# EAGLE design Soundtrap IMU board v4 RXTX switch (EAGLE 9.5.2)
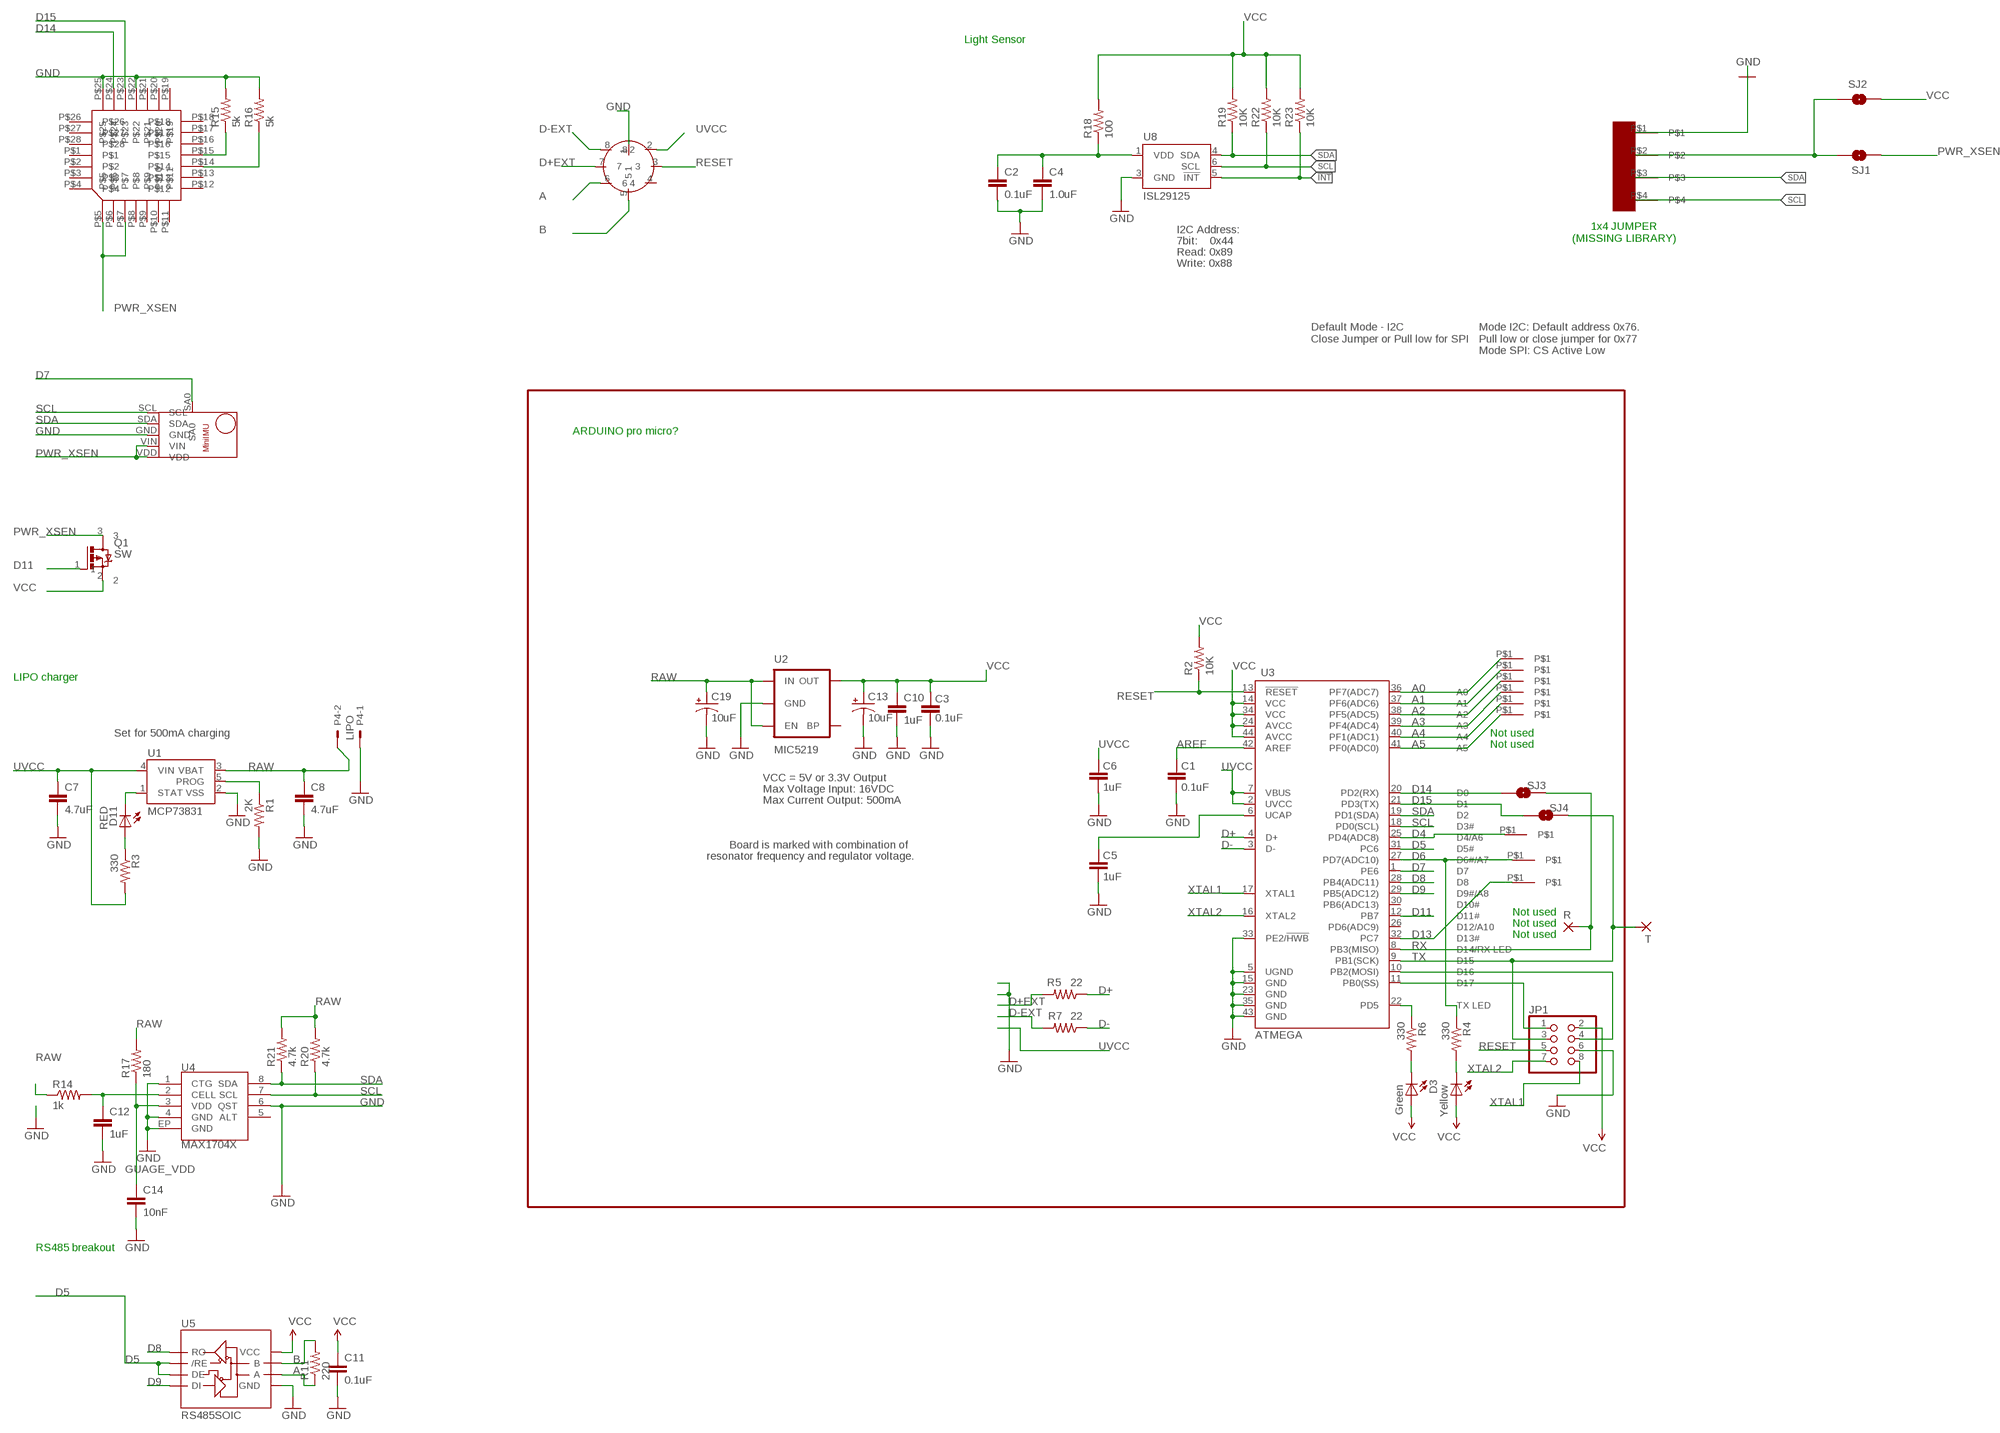
[diagram p0: schematic, sheet 1]

## Parts
C1  0.1uF  CAP0603-CAP  [0603-CAP]
C2  0.1uF  0.1UF-25V(+80/-20%)(0603)  [0603-CAP]
C3  0.1uF  CAP0603-CAP  [0603-CAP]
C4  1.0uF  1.0UF-16V-10%(0603)  [0603-CAP]
C5  1uF  CAP0603-CAP  [0603-CAP]
C6  1uF  CAP0603-CAP  [0603-CAP]
C7  4.7uF  CAP0402-CAP  [0402-CAP]
C8  4.7uF  CAP0402-CAP  [0402-CAP]
C10  1uF  CAP0603-CAP  [0603-CAP]
C11  0.1uF  CAP0402-CAP  [0402-CAP]
C12  1uF  CAP0402-CAP  [0402-CAP]
C13  10uF  CAP_POL1206  [EIA3216]
C14  10nF  CAP0402-CAP  [0402-CAP]
C19  10uF  CAP_POL1206  [EIA3216]
D1  Yellow  LED0603  [LED-0603]
D3  Green  LED0603  [LED-0603]
D11  RED  LED0603  [LED-0603]
JP1  PINHD-2X4  [2X04]
P1  SUBCON_MICRO_8_EDGE_ORDERED  [SUBCON_MICRO_8_EDGE]
P2  MINI_IMU  [MINI_IMU]
P3  EXT_PRES  [EXT_PRES]
P4  LIPO  22-23-2021  [22-23-2021]
Q1  SW  INFINEON_BSS84P  [SOT23]
R  1,6/0,9  [1,6/0,9]
R1  2K  RESISTOR0402-RES  [0402-RES]
R2  10K  RESISTOR0603-RES  [0603-RES]
R3  330  RESISTOR0402-RES  [0402-RES]
R4  330  RESISTOR0603-RES  [0603-RES]
R5  22  RESISTOR0603-RES  [0603-RES]
R6  330  RESISTOR0603-RES  [0603-RES]
R7  22  RESISTOR0603-RES  [0603-RES]
R11  220  RESISTOR0402-RES  [0402-RES]
R14  1k  RESISTOR0402-RES  [0402-RES]
R15  5k  R-US_R0603  [R0603]
R16  5k  R-US_R0603  [R0603]
R17  180  RESISTOR0402-RES  [0402-RES]
R18  100  100OHM1/10W1%(0603)  [0603-RES]
R19  10K  10KOHM1/10W1%(0603)0603  [0603-RES]
R20  4.7k  RESISTOR0402-RES  [0402-RES]
R21  4.7k  RESISTOR0402-RES  [0402-RES]
R22  10K  10KOHM1/10W1%(0603)0603  [0603-RES]
R23  10K  10KOHM1/10W1%(0603)0603  [0603-RES]
SJ1  SJ1  SOLDERJUMPERNO  [SJ_2S-NO]
SJ2  3v3  SOLDERJUMPERNO  [SJ_2S-NO]
SJ3  SJ1  SOLDERJUMPERNO  [SJ_2S-NO]
SJ4  SJ1  SOLDERJUMPERNO  [SJ_2S-NO]
T  1,6/0,9  [1,6/0,9]
U1  MCP73831  [SOT23-5]
U2  MIC5219  V_REG_LDOSMD  [SOT23-5]
U3  ATMEGA  ATMEGA32U4OUTFAKES  [QFN-44-NOPAD_1:1-OUTFAKES]
U4  MAX1704X  [TDFN-8]
U5  RS485SOIC  [SO08]
U7  XSENSE  [MC-28PLCC-SMT]
U8  ISL29125  [ODFN-LD-6]
U$5  D4  TEST_POINT  [TEST_POINT]
U$6  TEST_POINT  [TEST_POINT]
U$7  TEST_POINT  [TEST_POINT]
U$8  TEST_POINT  [TEST_POINT]
U$9  TEST_POINT  [TEST_POINT]
U$10  TEST_POINT  [TEST_POINT]
U$11  TEST_POINT  [TEST_POINT]
U$12  TEST_POINT  [TEST_POINT]
U$13  TEST_POINT  [TEST_POINT]

## Nets
!INT: R23.1 U8.5(!INT)
A: P1.6 R11.1 U5.6(A)
A0: U3.36(PF7(ADC7)) U$8.P$1
A1: U3.37(PF6(ADC6)) U$9.P$1
A2: U3.38(PF5(ADC5)) U$10.P$1
A3: U3.39(PF4(ADC4)) U$11.P$1
A4: U3.40(PF1(ADC1)) U$12.P$1
A5: U3.41(PF0(ADC0)) U$13.P$1
AREF: C1.2 U3.42(AREF)
B: P1.5 R11.2 U5.7(B)
D4: U3.25(PD4(ADC8)) U$5.P$1
D5: U3.31(PC6) U5.2(/RE) U5.3(DE)
D6: R4.1 U3.27(PD7(ADC10)) U$6.P$1
D7: P2.SA0 U3.1(PE6)
D8: U3.28(PB4(ADC11)) U5.1(RO)
D9: U3.29(PB5(ADC12)) U5.4(DI)
D11: Q1.1 U3.12(PB7)
D13: U3.32(PC7) U$7.P$1
D14: SJ3.2 U3.20(PD2(RX)) U7.P$24
D15: SJ4.2 U3.21(PD3(TX)) U7.P$23
D+: R5.1 U3.4(D+)
D+EXT: P1.7 R5.2
D-: R7.1 U3.3(D-)
D-EXT: P1.8 R7.2
EXT_PRES_POW: P3.P$2 SJ1.2 SJ2.1
GND [vcc]: C1.1 C2.2 C3.1 C4.2 C5.1 C6.1 C7.2 C8.2 C10.2 C11.2 C12.2 C13.C(-) C14.2 C19.C(-) JP1.6 P1.1 P2.GND P3.P$1 P4.1 R1.2 R15.2 R16.2 U1.2(VSS) U2.2(GND) U3.5(UGND) U3.15(GND) U3.23(GND) U3.33(PE2/!HWB) U3.35(GND) U3.43(GND) U4.1(CTG) U4.4(GND) U4.6(QST) U4.EP(GND) U5.5(GND) U7.P$22 U7.P$25 U8.3(GND)
GUAGE_VDD: C14.1 R17.1 U4.3(VDD)
MISO: JP1.1 U3.11(PB0(SS))
MOSI: JP1.4 U3.10(PB2(MOSI))
N$1: C2.1 C4.1 R18.1 U8.1(VDD)
N$3: D11.A R3.1
N$4: C5.2 U3.6(UCAP)
N$5: D1.C R4.2
N$6: C12.1 R14.2 U4.2(CELL)
N$7: D3.C R6.2
N$9: R15.1 U7.P$15
N$13: R16.1 U7.P$14
PROG: R1.1 U1.5(PROG)
PWR_XSEN: P2.VDD P2.VIN Q1.3 SJ1.1 U7.P$5 U7.P$7
RAW [vcc]: C8.1 C19.A(+) P4.2 R14.1 R17.2 R20.2 R21.2 U1.3(VBAT) U2.1(IN) U2.3(EN)
RESET: JP1.5 P1.3 R2.1 U3.13(!RESET)
RX: R.1(P) SJ3.1 U3.8(PB3(MISO))
SCL: P2.SCL P3.P$4 R20.1 R22.1 U3.18(PD0(SCL)) U4.7(SCL) U8.6(SCL)
SDA: P2.SDA P3.P$3 R19.1 R21.1 U3.19(PD1(SDA)) U4.8(SDA) U8.4(SDA)
STAT: D11.C U1.1(STAT)
TX: JP1.3 SJ4.1 T.1(P) U3.9(PB1(SCK))
TXLED: R6.1 U3.22(PD5)
UVCC [vcc]: C6.2 C7.1 P1.2 R3.2 U1.4(VIN) U3.2(UVCC) U3.7(VBUS)
VCC [vcc]: C3.2 C10.1 C11.1 C13.A(+) D1.A D3.A JP1.2 Q1.2 R2.2 R18.2 R19.2 R22.2 R23.2 SJ2.2 U2.5(OUT) U3.14(VCC) U3.24(AVCC) U3.34(VCC) U3.44(AVCC) U5.8(VCC)
XTAL1: JP1.8 U3.17(XTAL1)
XTAL2: JP1.7 U3.16(XTAL2)
Unconnected: P1.4 U2.4(BP) U3.26(PD6(ADC9)) U3.30(PB6(ADC13)) U4.5(ALT) U7.P$1 U7.P$2 U7.P$3 U7.P$4 U7.P$6 U7.P$8 U7.P$9 U7.P$10 U7.P$11 U7.P$12 U7.P$13 U7.P$16 U7.P$17 U7.P$18 U7.P$19 U7.P$20 U7.P$21 U7.P$26 U7.P$27 U7.P$28

## Notes on the sheet
- Light Sensor
- 1x4 JUMPER
  (MISSING LIBRARY)
- I2C Address:
- 7bit:    0x44
- Read: 0x89
- Write: 0x88
- Default Mode - I2C
  Close Jumper or Pull low for SPI
- Mode I2C: Default address 0x76.
  Pull low or close jumper for 0x77
  Mode SPI: CS Active Low
- ARDUINO pro micro?
- LIPO charger
- Set for 500mA charging | Not used
- Not used
- VCC = 5V or 3.3V Output
- Max Voltage Input: 16VDC
- Max Current Output: 500mA
- Board is marked with combination of
- resonator frequency and regulator voltage.
- Not used
- Not used
- Not used
- RS485 breakout

## Library data of the parts
C1 C3 C5-C8 C10-C12 C14 = SparkFun:CAP: Capacitor Standard 0603 ceramic capacitor, and 0.1" leaded capacitor.
C2 = SparkFun-Capacitors:0.1UF-25V(+80/-20%)(0603): CAP-00810 Ceramic Standard decoupling cap; PROD_ID: CAP-00810
C4 = SparkFun-Capacitors:1.0UF-16V-10%(0603): CAP-00868; PROD_ID: CAP-00868
C13 C19 = SparkFun:CAP_POL: Capacitor Polarized These are standard SMD and PTH capacitors. Normally 10uF, 47uF, and 100uF in electrolytic and tantalum varieties. Always verify the external diameter of the through hole cap, it varies with capacity, voltage, and manufacturer. The EIA devices should be standard.
D1 D3 D11 = SparkFun:LED: LEDs Standard schematic elements and footprints for 5mm, 3mm, 1206, and 0603 sized LEDs. 5mm - Spark Fun Electronics SKU : COM-00529 (and others)
JP1 = pinhead:PINHD-2X4: PIN HEADER
P1 = subcon_micro_8:SUBCON_MICRO_8_EDGE_ORDERED
P2 = MiniIMU:MINI_IMU
P3 = EXT_PRES:EXT_PRES
P4 = con-molex:22-23-2021: .100" (2.54mm) Center Header - 2 Pin; MF: MOLEX; MPN: 22-23-2021; OC_FARNELL: 1462926; OC_NEWARK: 25C3832
Q1 = Infineon_BSS84P:INFINEON_BSS84P
R T = wirepad:1,6/0,9: THROUGH-HOLE PAD
R1-R7 R11 R14 R17 R20 R21 = SparkFun:RESISTOR: Resistor Basic schematic elements and footprints for 0603, 1206, and PTH resistors.
R15 R16 = resistor:R-US_: RESISTOR, American symbol
R18 = SparkFun-Resistors:100OHM1/10W1%(0603): RES-07863; PROD_ID: RES-07863
R19 R22 R23 = SparkFun-Resistors:10KOHM1/10W1%(0603): RES-00824; PROD_ID: RES-00824
SJ1-SJ4 = SparkFun-Passives:SOLDERJUMPER: Solder Jumper Standard SMD solder jumper. Used to automate production. Two varients : Normally Open and Normally Closed are the same, but have different paste layers. NC will have a large amount of paste and should jumper during reflow.
U1 = SparkFun:MCP73831: Microchip's MCP73831 Miniature single cell, fully integrated Li-Ion, Li-polymer charge management controller http://ww1.microchip.com/downloads/en/DeviceDoc/21984a.pdf
U2 = SparkFun:V_REG_LDO: Voltage Regulator LDO Standard 150mA LDO voltage regulator in SOT-23 layout. Micrel part MIC5205. BP (by-pass) pin is used to lower output noise with 470pF cap.
U3 = Testing:ATMEGA32U4: Atmel 44-pin 8-bit Microcontroller with 32KBytes of ISP Flash and USB Controller
U4 = SparkFun:MAX1704X: MAX17043/MAX17044: Battery Fuel Guage (43 is 1cell, 44 is 2cell)
U5 = SparkFun:RS485
U7 = xSense:XSENSE
U8 = SparkFun-Sensors:ISL29125: The ISL29125 is a low power, high sensitivity RGB color light sensor with an I2C interface.
U$5-U$13 = TEST_POINT:TEST_POINT

## Net classes
0 default: width 0.127 mm
1 vcc: width 0.203 mm

## Board
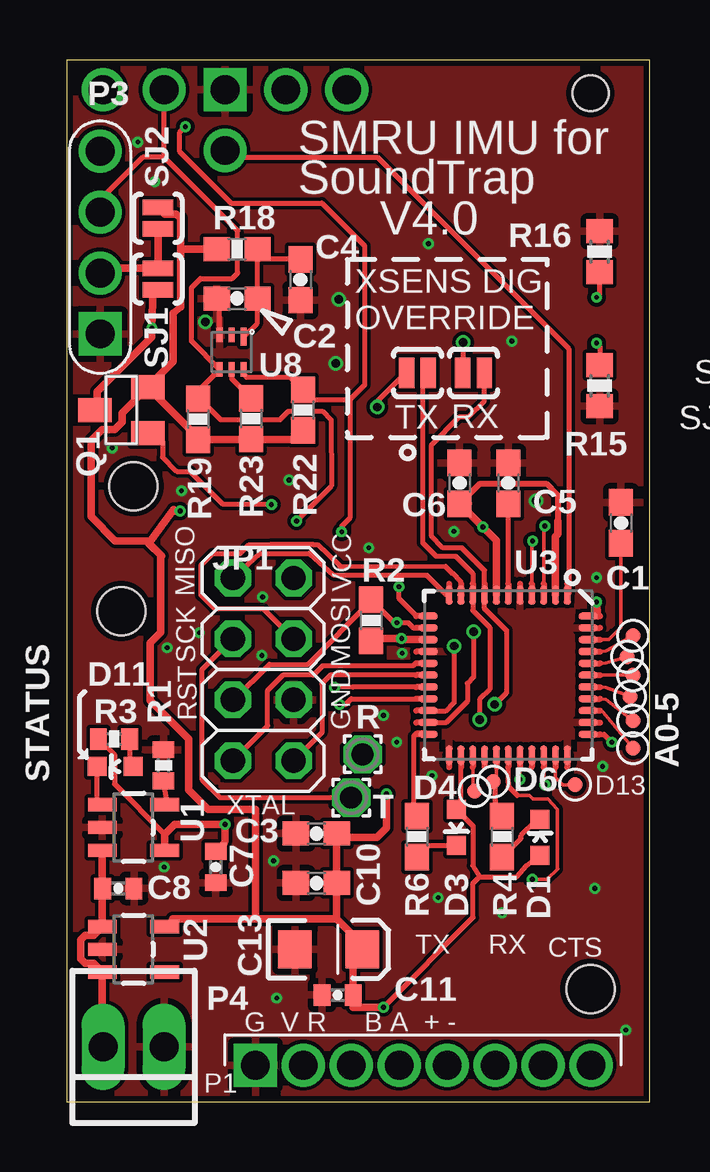
[diagram p1: board, top side]
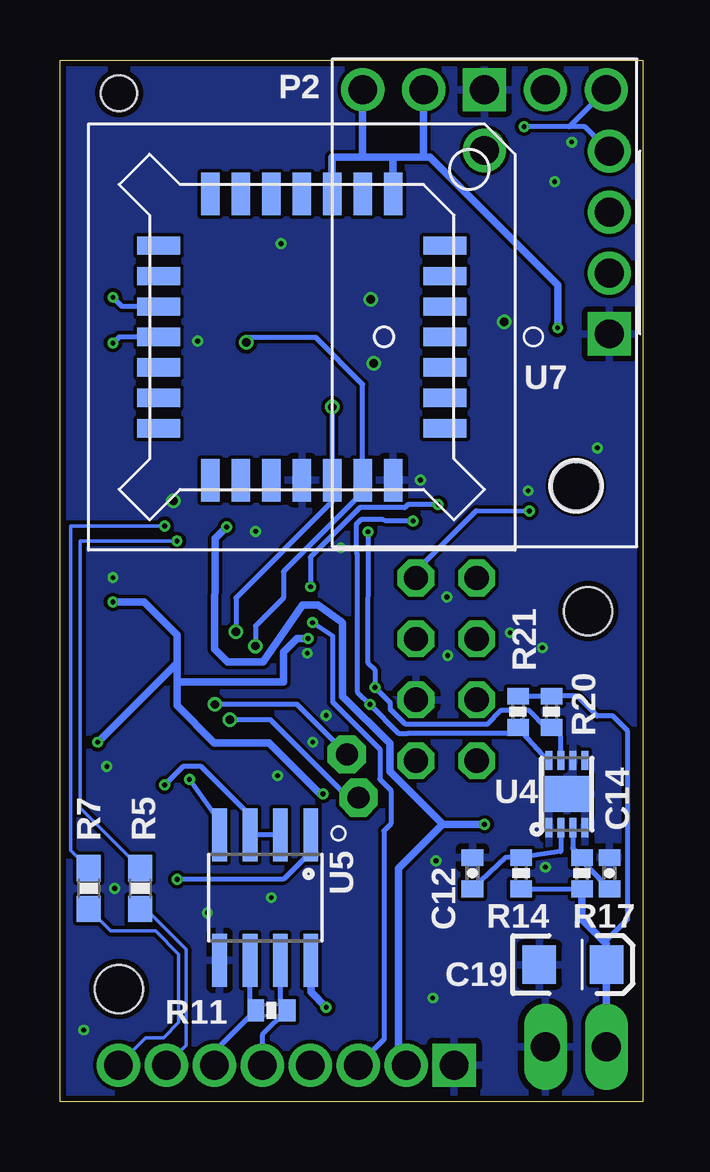
[diagram p2: board, bottom side, seen from below]

Size 24.31 x 43.42 mm. Coordinates in mm from the lower left corner, seen from the top.
Outline: 0,0 24.31,0 24.31,43.42 0,43.42 0,0
Copper layers (1*16): Top 0.035mm / dielectric 1.5mm / Bottom 0.035mm
Design rules "pcbTrainGW *": minimum track width 0.125mm, minimum drill 0.2mm, track to track 6mil, track to pad 6mil, pad to pad 6mil, via to via 6mil, smd to smd 6mil, copper to edge 0.25mm, drill to drill 0.2mm, minimum pad ring 5mil, minimum via ring 5mil, stop-mask expansion 4mil, vias tented up to drill 0mil, thermal gap 10mil
Holes 2 mm at 2.29,20.45 21.84,4.7 2.79,25.65
Holes 1.5 mm at 21.84,42.04

### Footprints (pad centres in the part's own frame; a part is rotated, then mirrored left to right if it is on the bottom)
0603-CAP = smd 1.1 x 1: 1 -0.85,0; 2 0.85,0
0402-CAP = smd 0.7 x 0.9: 1 -0.65,0; 2 0.65,0
EIA3216 = smd 1.4 x 1.6: A 1.4,0; C -1.4,0
LED-0603 = smd 0.8 x 0.8: A 0,-0.75; C 0,0.75
2X04 = drill 1.016 octagon: 1 -3.81,-1.27; 2 -3.81,1.27; 3 -1.27,-1.27; 4 -1.27,1.27; 5 1.27,-1.27; 6 1.27,1.27; 7 3.81,-1.27; 8 3.81,1.27
SUBCON_MICRO_8_EDGE = drill 1.2 square: 1 0,0 | drill 1.2: 2 2,0; 3 4,0; 4 6,0; 5 8,0; 6 10,0; 7 12,0; 8 14,0
MINI_IMU = drill 1.2 square: GND 6.35,1.27 | drill 1.2: SA0 6.35,3.81; SCL 1.27,1.27; SDA 3.81,1.27; VDD 11.43,1.27; VIN 8.89,1.27
EXT_PRES = drill 1.2 square: P$1 0,0 | drill 1.2: P$2 0,-2.54; P$3 0,-5.08; P$4 0,-7.62
22-23-2021 = drill 1.2 long: 1 -1.27,0; 2 1.27,0
SOT23 = smd 1 x 1.4: 1 -0.95,-1.1; 2 0.95,-1.1; 3 0,1.1
1,6/0,9 = drill 0.914 pad 1.6 octagon: 1 0,0
0402-RES = smd 0.7 x 0.9: 1 -0.65,0; 2 0.65,0
0603-RES = smd 1.1 x 1: 1 -0.85,0; 2 0.85,0
R0603 = smd 1 x 1.1: 1 -0.85,0; 2 0.85,0
SJ_2S-NO = smd 0.635 x 1.27: 1 -0.45,0; 2 0.45,0
SOT23-5 = smd 0.55 x 1.2: 1 -0.95,-1.3; 2 0,-1.3; 3 0.95,-1.3; 4 0.95,1.3; 5 -0.95,1.3
QFN-44-NOPAD_1:1-OUTFAKES = smd 0.8 x 0.3: 1 -3.337,2.465; 2 -3.337,1.972; 3 -3.337,1.479; 4 -3.337,0.986; 5 -3.337,0.493; 6 -3.337,0; 7 -3.337,-0.493; 8 -3.337,-0.986; 9 -3.337,-1.479; 10 -3.337,-1.972; 11 -3.337,-2.465; 23 3.337,-2.465; 24 3.337,-1.972; 25 3.337,-1.479; 26 3.337,-0.986; 27 3.337,-0.493; 28 3.337,0; 29 3.337,0.493; 30 3.337,0.986; 31 3.337,1.479; 32 3.337,1.972; 33 3.337,2.465 | smd 0.3 x 0.8: 12 -2.465,-3.337; 13 -1.972,-3.337; 14 -1.479,-3.337; 15 -0.986,-3.337; 16 -0.493,-3.337; 17 0,-3.337; 18 0.493,-3.337; 19 0.986,-3.337; 20 1.479,-3.337; 21 1.972,-3.337; 22 2.465,-3.337; 34 2.465,3.337; 35 1.972,3.337; 36 1.479,3.337; 37 0.986,3.337; 38 0.493,3.337; 39 0,3.337; 40 -0.493,3.337; 41 -0.986,3.337; 42 -1.479,3.337; 43 -1.972,3.337; 44 -2.465,3.337
TDFN-8 = smd 0.8 x 0.3: 1 -1.4,0.75; 2 -1.4,0.25; 3 -1.4,-0.25; 4 -1.4,-0.75; 5 1.4,-0.75; 6 1.4,-0.25; 7 1.4,0.25; 8 1.4,0.75 | smd 1.5 x 1.88: EP 0,0
SO08 = smd 0.61 x 2.21: 1 -1.905,-2.616; 2 -0.635,-2.616; 3 0.635,-2.616; 4 1.905,-2.616; 5 1.905,2.616; 6 0.635,2.616; 7 -0.635,2.616; 8 -1.905,2.616
MC-28PLCC-SMT = smd 1.778 x 0.762: P$1 -5.969,0; P$2 -5.969,-1.27; P$3 -5.969,-2.54; P$4 -5.969,-3.81; P$12 5.969,-3.81; P$13 5.969,-2.54; P$14 5.969,-1.27; P$15 5.969,0; P$16 5.969,1.27; P$17 5.969,2.54; P$18 5.969,3.81; P$26 -5.969,3.81; P$27 -5.969,2.54; P$28 -5.969,1.27 | smd 0.762 x 1.778: P$5 -3.81,-5.969; P$6 -2.54,-5.969; P$7 -1.27,-5.969; P$8 0,-5.969; P$9 1.27,-5.969; P$10 2.54,-5.969; P$11 3.81,-5.969; P$19 3.81,5.969; P$20 2.54,5.969; P$21 1.27,5.969; P$22 0,5.969; P$23 -1.27,5.969; P$24 -2.54,5.969; P$25 -3.81,5.969
ODFN-LD-6 = smd 0.75 x 0.25: 1 -0.645,0.5 | smd 0.6 x 0.25: 2 -0.72,0; 3 -0.72,-0.5; 4 0.72,-0.5; 5 0.72,0; 6 0.72,0.5
TEST_POINT = smd 0.635 x 0.635: P$1 0,0

### Placement (x,y rotation side)
C1  23.11,24.13 270 top
C2  7.11,33.48 180 top
C3  10.41,11.18 0 top
C4  9.75,34.26 270 top
C5  18.41,25.78 270 top
C6  16.38,25.78 270 top
C7  6.22,9.78 270 top
C8  2.16,8.89 0 top
C10  10.41,9.12 180 top
C11  11.3,4.45 180 top
C12  7.11,9.53 90 bottom
C13  10.92,6.35 0 top
C14  1.4,9.53 90 bottom
C19  2.92,5.71 0 bottom
D1  19.74,11.02 0 top
D3  16.26,11.43 180 top
D11  2.03,13.97 90 top
JP1  8.2,18.02 270 top
P1  7.87,1.52 0 top
P2  0.25,43.46 180 bottom
P3  1.4,32 180 top
P4  2.79,2.29 180 top
Q1  2.29,28.83 90 top
R  12.34,14.48 0 top
R1  4.04,14.02 90 top
R2  12.7,20.07 270 top
R3  1.98,15.11 180 top
R4  18.16,11.05 270 top
R5  20.95,8.89 270 bottom
R6  14.61,11.05 270 top
R7  23.11,8.89 270 bottom
R11  15.49,3.81 0 bottom
R14  5.08,9.53 90 bottom
R15  22.23,29.84 270 top
R16  22.23,35.43 90 top
R17  2.54,9.53 270 bottom
R18  7.11,35.53 180 top
R19  5.49,28.45 270 top
R20  3.81,16.26 90 bottom
R21  5.21,16.26 90 bottom
R22  9.86,28.83 270 top
R23  7.7,28.47 270 top
SJ1  3.81,34.29 90 top
SJ2  3.81,36.83 90 top
SJ3  16.97,30.38 180 top
SJ4  14.63,30.38 180 top
T  11.86,12.67 0 top
U1  2.79,11.43 270 top
U2  2.79,6.35 270 top
U3  18.41,17.78 270 top
U4  3.17,12.83 90 bottom
U5  15.75,8.51 180 bottom
U7  14.22,31.88 180 bottom
U8  6.88,31.24 270 top
U$5  17.02,12.95 0 top
U$6  17.78,13.34 0 top
U$7  21.21,13.21 0 top
U$8  23.62,14.73 0 top
U$9  23.62,15.88 0 top
U$10  23.5,16.89 0 top
U$11  23.62,17.78 0 top
U$12  23.37,18.54 0 top
U$13  23.62,19.43 0 top

### Tracks (layer width: path | path; a pad name or v marks a point on that pad's centre or on a via)
!INT
  Top 0.203: U8.5 6.88,30.14 R23.1
A
  Bottom 0.203: P1.6 17.87,2.08 R11.1 16.38,4.05 U5.6
A0
  Top 0.152: U3.36 22.35,16.26 U$8.P$1
A1
  Top 0.152: U3.37 22.48,16.76 U$9.P$1
A2
  Top 0.152: U3.38 22.48,17.27 U$10.P$1
A3
  Top 0.152: U3.39 U$11.P$1
A4
  Top 0.152: U3.40 22.48,18.29 U$12.P$1
A5
  Top 0.152: U3.41 22.48,18.8 22.99,19.05 U$13.P$1
AREF
  Top 0.152: C1.2 23.11,19.77 22.61,19.26 U3.42
B
  Bottom 0.203: U5.7 15.11,4.08 R11.2 15.87,2.78 P1.5
D4
  Top 0.152: U3.25 16.94,13.04 U$5.P$1
D5  (via drill 0.2)
  Top 0.152: U3.31 19.89,13.25 v19.94,13.21
  Bottom 0.203: U5.2 U5.3 16.38,11.94 18.41,13.97 19.18,13.97 v19.94,13.21
D6
  Top 0.152: U3.27 17.92,13.6 U$6.P$1
  Top 0.203: U$6.P$1 17.88,13.23 17.88,12.52 17.88,11.9 R4.1
D7
  Top 0.203: P2.SA0 6.88,39.37 12.95,39.37 20.95,31.37 20.95,21.19 U3.1
D8  (via drill 0.2)
  Top 0.152: U3.28 18.41,14.05 18.41,13.56 | 18.79,12.76 19.3,12.76 19.44,12.61 20.06,12.61 20.47,12.19 20.47,9.71 20.48,9.7 20.03,9.26 v19.42,9.26
  Top 0.203: 18.41,13.31 18.41,14.05 | 18.41,13.56 18.41,13.31 | 18.41,13.31 18.41,13.14 18.79,12.76
  Bottom 0.203: U5.1 13.84,10.41 14.99,9.27 19.44,9.27 v19.43,9.26 v19.42,9.26
D9  (via drill 0.2)
  Top 0.152: U3.29 18.91,13.48 v18.91,13.44
  Bottom 0.203: U5.4 17.65,11.68 v18.91,13.44
D11  (via drill 0.2)
  Top 0.203: Q1.1 3.67,27.88 4,27.55 4,26.86 4.59,26.27 5.16,26.27 6.53,24.9 v8.54,24.9 | v13.86,21.47 13.86,20.98 14.6,20.25 U3.12
  Bottom 0.203: v8.54,24.9 8.55,24.89 9.8,24.89 9.93,24.77 11.8,24.77 13.86,22.7 v13.86,21.47
D13
  Top 0.152: U3.32 20.39,13.52 20.7,13.21 U$7.P$1
D14  (via drill 0.35)
  Top 0.203: v16.15,19 16.15,16.64 15.79,16.28 15.1,16.28 U3.20 | SJ3.2 16.47,30.43 16.54,30.5 v16.54,31.65
  Bottom 0.203: v16.15,19 16.15,19.84 14.99,21.01 14.99,22.1 11.68,25.4 U7.P$24 11.68,29.9 13.64,31.85 16.43,31.85 16.54,31.75 v16.54,31.65
D15  (via drill 0.35)
  Top 0.203: v16.97,19.58 16.97,17.7 16.71,17.44 16.71,16.69 15.82,15.79 15.09,15.79 U3.21 | SJ4.2 14.12,30.38 12.95,29.21 v12.95,28.96
  Bottom 0.203: v16.97,19.58 16.97,21.01 12.95,25.02 U7.P$23 v12.95,28.96
D+  (via drill 0.2)
  Top 0.152: U3.4 19.4,23.34 v19.43,23.37
  Bottom 0.152: v19.43,23.37 23.47,23.37 23.47,12.26 R5.1
D+EXT
  Bottom 0.152: R5.2 20.74,8.04 19.05,6.35 19.05,2.35 P1.7
D-  (via drill 0.2)
  Top 0.152: U3.3 19.89,23.96 v19.94,24
  Bottom 0.152: v19.94,24 23.85,24 23.85,10.48 R7.1
D-EXT
  Bottom 0.152: R7.2 22.19,7.11 20.32,7.11 19.36,6.15 19.36,3.3 19.99,2.67 20.73,2.67 P1.8
EXT_PRES_POW
  Top 0.305: SJ2.1 SJ1.2 1.59,34.74 P3.P$2
GND  (via drill 0.2, 0.35)
  Top 0.203: U8.3 6.38,33.18 6.39,33.19 6.39,33.48 C2.2
  other vias: 4.79,25.47 22.35,13.97 22.1,21.84 15.24,13.59 15.09,35.76 4.19,18.92 8.76,4.32 15.49,8.51 18.16,7.87 8.64,10.03 9.27,25.91 3.68,38.35 18.57,31.7 23.32,2.99 8.17,21.04 8.14,18.6 5.54,19.55 4.06,9.78 11.35,33.45 11.23,30.78 19.58,25.04 5.79,32.51 13.77,14.99 13.21,16.1 14,18.69 1.91,27.25 16.15,23.77 2.97,40.01 12.6,23.09 22.02,8.89
  pour Top: -1.02,44.45 -1.02,-3.81 25.65,-3.81 25.65,44.45
  pour Bottom: -1.02,44.45 -1.02,-3.81 25.65,-3.81 25.65,44.45
GUAGE_VDD
  Bottom 0.203: U4.3 2.92,10.56 R17.1 2.54,10.03 1.84,9.33 1.84,9.31 C14.1
MISO
  Top 0.203: JP1.1 8.04,22.86 10.13,22.86 11.12,21.96 15.01,21.95 15.85,21.12 U3.11
MOSI
  Top 0.203: JP1.4 8.22,20.54 6.19,20.54 5.61,21.12 5.61,22.36 6.09,22.85 7.24,22.85 7.62,23.22 8.06,23.22 8.48,23.22 10.31,23.22 10.46,23.22 11.4,22.32 15.81,22.32 16.08,22.03 16.08,22.04 16.43,21.69 U3.10
  Top 0.305: U3.10
N$1
  Top 0.203: U8.1 7.96,32.47 C2.1 7.96,35.18 | 7.96,35.18 R18.1 | C4.1 8.03,35.12 7.96,35.18
N$3
  Top 0.203: D11.A 2.68,14.07 R3.1
N$4
  Top 0.203: U3.6 C5.2 | C5.2
N$5
  Top 0.152: D1.C 19.62,11.77 19.54,11.68
  Top 0.203: R4.2 18.95,10.98 18.95,11.09 19.54,11.68
N$6
  Bottom 0.203: U4.2 3.42,10.43 R14.2 5.71,10.18 C12.1
N$7
  Top 0.203: R6.2 15.09,10.68 D3.C
N$9  (via drill 0.2)
  Top 0.203: v22.1,31.62 22.23,31.5 R15.1
  Bottom 0.203: U7.P$15 21.84,31.88 v22.1,31.62
N$13  (via drill 0.2)
  Top 0.203: v22.1,33.53 22.23,33.66 R16.1
  Bottom 0.203: U7.P$14 21.72,33.15 v22.1,33.53
PROG
  Top 0.203: U1.5 4.19,12.48 R1.1
PWR_XSEN  (via drill 0.2)
  Top 0.305: SJ1.1 3.61,33.84 v3.56,32.26 3.56,31.88 1.27,29.59 1.27,28.91 Q1.3
  Bottom 0.305: U7.P$5 10.41,39.37 | 11.68,39.37 10.41,39.37 | 11.68,39.37 12.95,39.37 U7.P$7 | 10.41,39.37 9.14,39.37 | 9.14,39.37 P2.VIN | P2.VDD 11.68,39.37 | 9.14,39.37 8.89,39.37 3.56,34.04 v3.56,32.26
RAW
  Top 0.305: U1.3 1.49,8.9 C8.1 1.49,8.88 U2.1 1.12,6.93 0.77,6.93 0.59,6.75 0.59,5.95 0.77,5.77 1.12,5.77 U2.3 1.49,2.32 P4.2
  Bottom 0.203: R21.2 R20.2 2.93,16.91 2.74,16.91 1.91,16.07 1.25,16.07 0.64,15.45 0.64,7.62 1.52,6.73 1.52,6.59 | R14.1 R17.2
  Bottom 0.305: R17.2 2.54,7.61 1.52,6.59 C19.A P4.2
RESET  (via drill 0.2)
  Top 0.203: JP1.5 6.97,16.75 8.45,18.23 10.07,18.23 12.7,20.86 R2.1 12.71,20.92 13.66,19.97 v13.78,19.97 14.24,19.97 14.45,19.75 U3.13
  Bottom 0.203: v13.78,19.97 12.93,19.4 12.93,16.64 10.97,14.69 10.97,13.44 10.52,12.98 10.52,11.58 10.81,11.29 10.81,2.59 P1.3
RX  (via drill 0.35)
  Top 0.203: v17.86,16.56 18.34,17.04 18.34,19.64 17.43,20.56 U3.8 17.43,22.14 16.48,23.09 15.7,23.09 15.21,23.57 15.21,27.38 16.38,28.55 16.76,28.55 17.42,29.2 SJ3.1
  Bottom 0.203: R.1 14.43,16.56 v17.86,16.56
SCL  (via drill 0.2)
  Top 0.203: U3.18 11.92,17.29 v11.18,17.27 | v4.95,40.64 4.7,40.39 4.7,39.62 6.86,37.47 10.64,37.47 12.43,35.68 12.43,29.88 11.81,29.26 | 11.81,29.26 11.81,24.34 11.47,24 v11.47,23.76 | U8.6 7.38,30.32 7.5,30.2 9.32,30.2 9.84,29.68 R22.1 10.27,29.26 11.81,29.26
  Bottom 0.203: P2.SCL 3.07,40.64 | 3.07,40.64 v4.95,40.64 | U4.7 3.42,15.22 R20.1 4.05,15.61 4.74,16.3 5.94,16.3 6.5,15.73 9.9,15.73 10.53,16.36 10.53,16.62 v11.18,17.27 11.18,18.02 11.47,18.32 v11.47,23.76 | P3.P$4 2.41,40.64 3.07,40.64
SDA  (via drill 0.2)
  Top 0.203: 4.06,39.37 7.13,36.3 7.13,34.54 6.91,34.31 5.59,34.31 5.21,33.93 5.21,31.7 U8.4 5.49,29.62 R19.1 5.56,29.3 6.43,28.43 8.9,28.43 9.25,28.78 10.67,28.78 11.03,28.42 11.04,25.67 v9.58,24.21 | 4.06,39.37 P2.SDA | 4.06,39.37 3.17,39.37 1.4,37.59 P3.P$3 | v11.39,16.55 11.63,16.55 11.86,16.79 U3.19
  Bottom 0.203: U4.8 3.96,14.23 R21.1 5.08,15.88 5.48,15.35 9.79,15.36 10.19,15.36 v11.39,16.55 11.92,17.09 11.92,18.34 11.93,22.83 11.96,22.98 11.96,24.06 11.81,24.21 11.75,24.26 10.84,24.26 10.71,24.21 10.21,24.21 9.9,24.21 v9.58,24.21
STAT
  Top 0.203: U1.1 1.28,12.59 D11.C
TX  (via drill 0.35)
  Top 0.203: v17.22,15.93 17.22,16.76 17.65,17.19 17.65,19.77 16.94,20.48 U3.9 16.94,22.02 16.23,22.73 15.42,22.73 14.86,23.29 14.86,30.16 SJ4.1 | JP1.3 5.64,18 5.64,13.44 6.4,12.68 T.1
  Bottom 0.203: T.1 12.29,12.68 15.54,15.93 v17.22,15.93
TXLED
  Top 0.203: U3.22 15.03,15.37 14.61,15.37 14.48,15.24 14.48,12.03 R6.1
UVCC  (via drill 0.2)
  Top 0.203: R3.2 2,14.49 2,13.24 4.09,11.15 | 20.49,23.67 20.45,23.62
  Top 0.254: 16.76,24.93 16.76,25.28 17.24,25.76 20,25.76 20.49,25.27 20.49,24.21
  Top 0.305: U1.4 4.09,11.15 4.5,11.56 v6.6,11.56 6.6,10.87 6.57,10.78 C7.1 | 16.76,24.93 C6.2 v17.36,23.95 17.92,23.39 U3.7 | U3.2 20.39,23.56 20.45,23.62 | 20.49,24.21 20.49,23.67
  Bottom 0.305: v6.6,11.56 8.34,11.56 | P1.2 10.2,1.85 10.2,9.72 8.36,11.56 8.34,11.56 | v17.36,23.95 17.83,23.48 17.85,18.86 17.33,18.34 15.84,18.34 14.19,20.7 13.55,20.7 12.59,20.02 12.52,19.96 12.52,16.9 10.55,14.94 10.55,13.77 8.34,11.56
VCC  (via drill 0.2)
  Top 0.203: U3.24 16.44,12.37 D3.A 16.95,11.49 16.94,9.83 17.21,9.39 17.22,9.38 | U3.34 22.4,15.31 v22.73,14.99 | U3.44 22.15,20.25 | v13.97,19.3 14.02,19.26 | R2.2 12.79,19.3 | D1.A 19.17,9.83 18.91,9.54 18.77,9.38 17.22,9.38 | v13.21,3.94 16.95,7.67 16.95,9.1 17.22,9.38 | 5.49,27.68 R19.2 | 4.75,35.64 4.85,35.53 | 9.47,27.6 R22.2 | 12.32,6.56 C13.A 12.32,6.22 11.95,5.85 | 4.41,7.62 U2.5 | 11.54,11.01 11.38,11.18 C3.2 | C10.1 11.26,7.62 | R23.2 8.91,27.62 8.94,27.6
  Top 0.305: 22.15,20.25 v22.1,20.83 | U3.14 14.02,19.26 | 7.87,7.62 4.41,7.62 | 7.87,7.62 11.26,7.62 | 12.79,19.3 v13.97,19.3 | 7.87,7.62 7.87,12.19 5.89,12.19 5.09,12.99 5.09,15.12 3.49,16.73 3.49,19.11 3.93,19.55 3.93,22.7 3.96,22.74 | 11.95,5.85 C11.1 11.95,3.94 v13.21,3.94 | SJ2.2 4.09,37 4.57,37 4.75,36.82 4.75,35.64 4.75,33.12 4.45,32.87 4.45,30.85 Q1.2 | Q1.2 2.32,28.71 2.32,28.33 2.01,28.02 1.48,28.02 1.02,27.56 1.02,24.38 2.03,23.37 3.33,23.37 3.96,22.74 | v13.34,12.83 13.34,11.4 12.94,11.01 11.54,11.01 | 3.96,22.74 3.41,23.27 4.47,24.68 4.52,24.63 v4.74,24.63 | Q1.2 5.49,27.68 | 4.85,35.53 R18.2 | R19.2 8.94,27.6 9.47,27.6 | 11.26,7.62 C3.2 | 12.32,6.56 11.26,7.62
  Bottom 0.203: v4.74,24.63 6.94,24.64 9.46,22.11 JP1.2
  Bottom 0.305: v22.1,20.83 20.8,20.83 19.43,19.46 19.43,18.29 | 19.43,17.5 14.99,17.5 14.99,18.75 14.43,19.3 v13.97,19.3 | 19.43,18.29 v22.73,14.99 | U5.8 13.84,4.57 v13.21,3.94 | v13.34,12.83 13.46,12.83 15.6,14.96 17.88,14.96 19.43,16.51 19.43,17.5 | 19.43,18.29 19.43,17.5
XTAL1
  Top 0.203: U3.17 11,17.78 10.7,17.47 10.7,17.45 10.64,17.4 10.64,15.39 JP1.8
XTAL2
  Top 0.203: JP1.7 8.38,15.67 8.38,17.14 9.02,17.78 10.29,17.78 10.68,18.17 14.44,18.17 14.54,18.27 U3.16

### Text on the board
tPlace: XSENS DIG / OVERRIDE | TX | RX
tNames: SMRU IMU for | SoundTrap | V4.0 | MISO | VCC | SCK | MOSI | RST | GND | A0-5 | STATUS | XTAL | D4 | D6 | D13 | TX | RX | CTS | G V R B A + -